# EAGLE design I-GAUGE arduino pro mini Instalasi 2 (EAGLE 7.5.0)
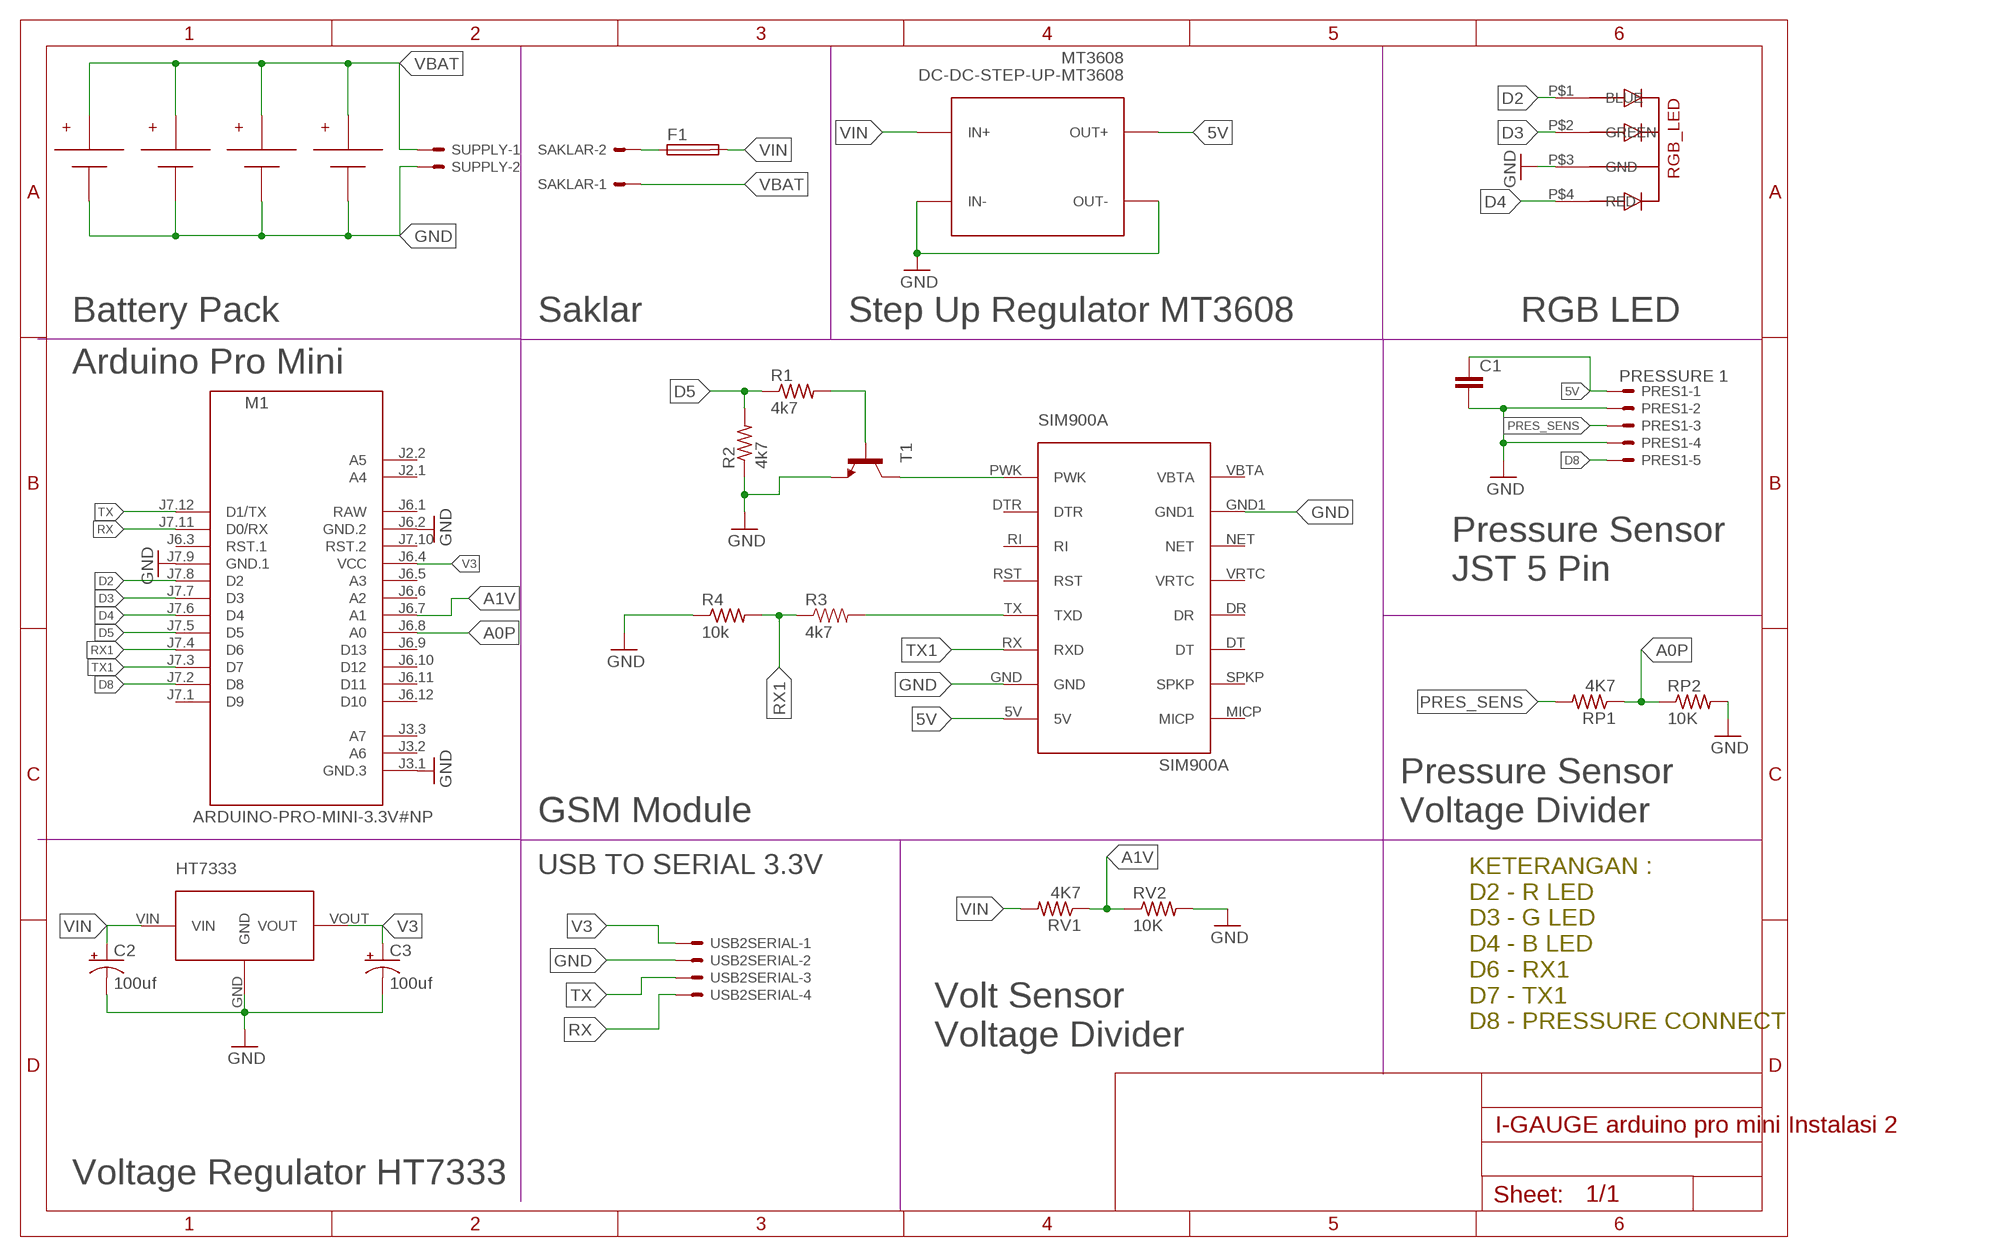
[diagram p0: schematic, sheet 1]

## Parts
C1  C-EUC1206  [C1206]
C2  100uf  CPOL-USCT7343  [CT7343]
C3  100uf  CPOL-USCT7343  [CT7343]
F1  FUSESH22,5  [SH22,5]
HT7333  HT7333_SOT89  [SOT89]
M1  ARDUINO-PRO-MINI-3.3V#NP  [ARDUINO-PRO-MINI#NP]
MT3608  DC-DC-STEP-UP-MT3608  [DC-DC-STEP-UP-MT3608]
PRES1  PRESSURE 1  JST-XH-05-PIN-ROUND-PAD  [JST-XH-05-PACKAGE-ROUND-PAD]
R1  4k7  R-US_R1206  [R1206]
R2  4k7  R-US_R1206  [R1206]
R3  4k7  RESISTOR1206  [1206]
R4  10k  R-US_R1206  [R1206]
RGB_LED  5MMRGBLED  [LED5MMRGB]
RP1  4K7  R-US_M1206  [M1206]
RP2  10K  R-US_M1206  [M1206]
RV1  4K7  R-US_M1206  [M1206]
RV2  10K  R-US_M1206  [M1206]
SAKLAR  JST-XH-02-PIN-ROUND-PAD  [JST-XH-02-PACKAGE-ROUND-PAD]
SUPPLY  JST-XH-02-PIN-ROUND-PAD  [JST-XH-02-PACKAGE-ROUND-PAD]
T1  -NPN-TO92  [TO92]
U$1  SMT18650  [18650SMT]
U$2  SMT18650  [18650SMT]
U$3  SMT18650  [18650SMT]
U$4  SMT18650  [18650SMT]
U$6  SIM900A  [SIM900A]
USB2SERIAL  JST-XH-04-PIN-ROUND-PAD  [JST-XH-04-PACKAGE-ROUND-PAD]

## Nets
5V: C1.1 MT3608.OUT+ PRES1.1 U$6.5V
A0P: M1.J6.8(A0) RP1.1 RP2.1
A1V: M1.J6.7(A1) RV1.1 RV2.1
D2: M1.J7.8(D2) RGB_LED.P$1(BLUE)
D3: M1.J7.7(D3) RGB_LED.P$2(GREEN)
D4: M1.J7.6(D4) RGB_LED.P$4(RED)
D5: M1.J7.5(D5) R1.1 R2.2
D8: M1.J7.2(D8) PRES1.5
GND: C1.2 C2.- C3.- HT7333.GND M1.J3.1(GND.3) M1.J6.2(GND.2) M1.J7.9(GND.1) MT3608.IN- MT3608.OUT- PRES1.2 PRES1.4 R2.1 R4.1 RGB_LED.P$3(GND) RP2.2 RV2.2 SUPPLY.2 T1.1(E) U$1.BATTERY_NEGATIVE(-) U$2.BATTERY_NEGATIVE(-) U$3.BATTERY_NEGATIVE(-) U$4.BATTERY_NEGATIVE(-) U$6.GND U$6.GND1 USB2SERIAL.2
N$3: R1.2 T1.2(B)
N$4: R3.2 U$6.TX(TXD)
N$5: T1.3(C) U$6.PWK
PRES_SENS: PRES1.3 RP1.2
RX: M1.J7.11(D0/RX) USB2SERIAL.4
RX1: M1.J7.4(D6) R3.1 R4.2
TX: M1.J7.12(D1/TX) USB2SERIAL.3
TX1: M1.J7.3(D7) U$6.RX(RXD)
V3: C3.+ HT7333.VOUT M1.J6.4(VCC) USB2SERIAL.1
VBAT: SAKLAR.1 SUPPLY.1 U$1.BATTERY_POSITIVE(+) U$2.BATTERY_POSITIVE(+) U$3.BATTERY_POSITIVE(+) U$4.BATTERY_POSITIVE(+)
VCC: F1.1 SAKLAR.2
VIN: C2.+ F1.2 HT7333.VIN MT3608.IN+ RV1.2
Unconnected: M1.J2.1(A4) M1.J2.2(A5) M1.J3.2(A6) M1.J3.3(A7) M1.J6.3(RST.1) M1.J6.5(A3) M1.J6.6(A2) M1.J6.9(D13) M1.J6.10(D12) M1.J6.11(D11) M1.J6.12(D10) M1.J7.1(D9) M1.J7.10(RST.2) U$6.DR U$6.DT U$6.DTR U$6.MICP U$6.NET U$6.RI U$6.RST U$6.SPKP U$6.VBTA U$6.VRTC

## Notes on the sheet
- Battery Pack | Saklar | Step Up Regulator MT3608 | RGB LED
- Arduino Pro Mini
- Pressure Sensor
  JST 5 Pin
- GSM Module
- Pressure Sensor
  Voltage Divider
- USB TO SERIAL 3.3V
- KETERANGAN :
  D2 - R LED
  D3 - G LED
  D4 - B LED
  D6 - RX1
  D7 - TX1
  D8 - PRESSURE CONNECT
- Volt Sensor
  Voltage Divider
- Voltage Regulator HT7333

## Power pins joined to a net without a drawn wire
RAW: M1.J6.1(RAW)

## Library data of the parts
C1 = rcl:C-EU: CAPACITOR, European symbol
C2 C3 = resistor:CPOL-US: POLARIZED CAPACITOR, American symbol
F1 = fuse:FUSE: Fuse; OC_FARNELL: unknown; OC_NEWARK: unknown
HT7333 = HT7333_SOT89:HT7333_SOT89: SOT89
M1 = diy-modules:ARDUINO-PRO-MINI-*#NP: Arduino Pro Mini (and compatible devices) without programming pads More details available here: https://www.arduino.cc/en/Main/ArduinoBoardProMini Click here to find device on ebay.com <http://www.ebay.com/sch/arduino+pro+mini>
MT3608 = diy-modules:DC-DC-STEP-UP-MT3608: DC/DC Step-Up Regulator based on MT3608 chip MT3608 datasheet available here: https://www.olimex.com/Products/Breadboarding/BB-PWR-3608/resources/MT3608.pdf Click here to find device on ebay.com <http://www.ebay.com/sch/mt3608+module>
PRES1 = jst XH:JST-XH-05-PIN: JST XH Connector 2 Pin Wire to board connector. Pitch: 2,54 mm, (0.100") Number of pins: 5 Created by Rembrandt Electronics www.rembrandtelectronics.com
R1 R2 R4 RP1 RP2 RV1 RV2 = resistor:R-US_: RESISTOR, American symbol
R3 = SparkFun-3-2-07:RESISTOR: Resistor Basic schematic elements and footprints for 0603, 1206, and PTH 1/10th watt (small) resistors.
RGB_LED = led_rgb:5MMRGBLED
SAKLAR SUPPLY = jst XH:JST-XH-02-PIN: JST XH Connector 2 Pin Wire to board connector. Pitch: 2,54 mm, (0.100") Number of pins: 2 Created by Rembrandt Electronics www.rembrandtelectronics.com
T1 = transistor:*-NPN-: NPN Transistror BF959 corrected 2008.03.06
U$1-U$4 = SMT18650:SMT18650
U$6 = SIM900A GSM MODULE:SIM900A
USB2SERIAL = jst XH:JST-XH-04-PIN: JST XH Connector 2 Pin Wire to board connector. Pitch: 2,54 mm, (0.100") Number of pins: 4 Created by Rembrandt Electronics www.rembrandtelectronics.com

## Board
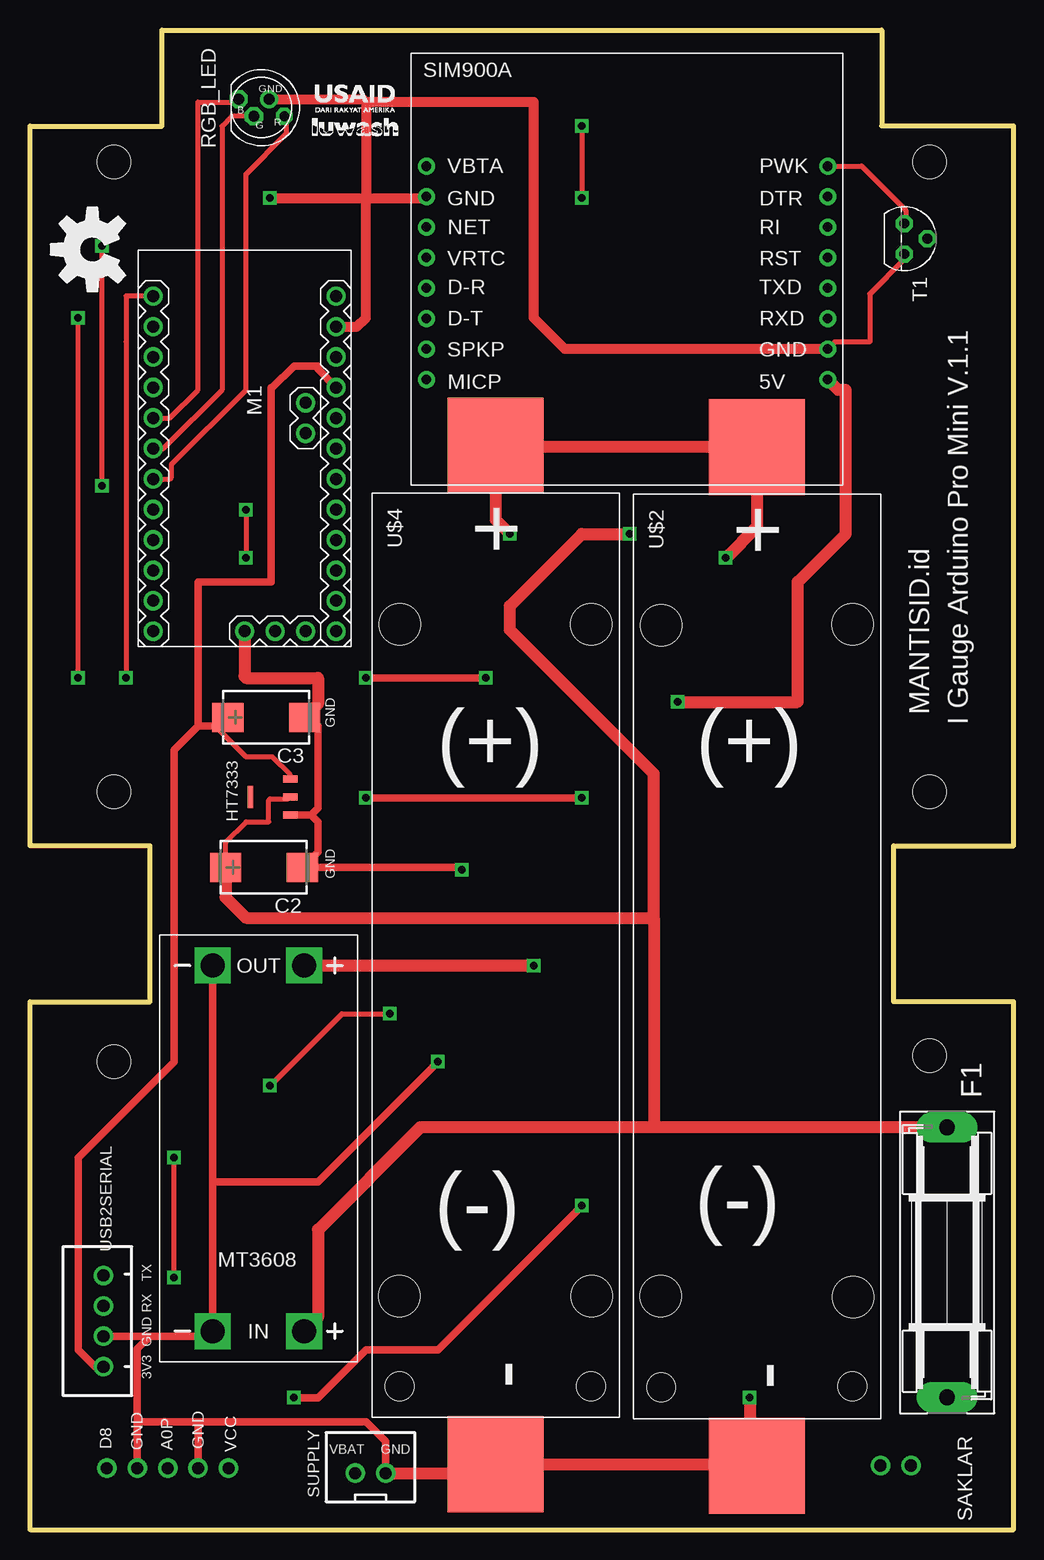
[diagram p1: board, top side]
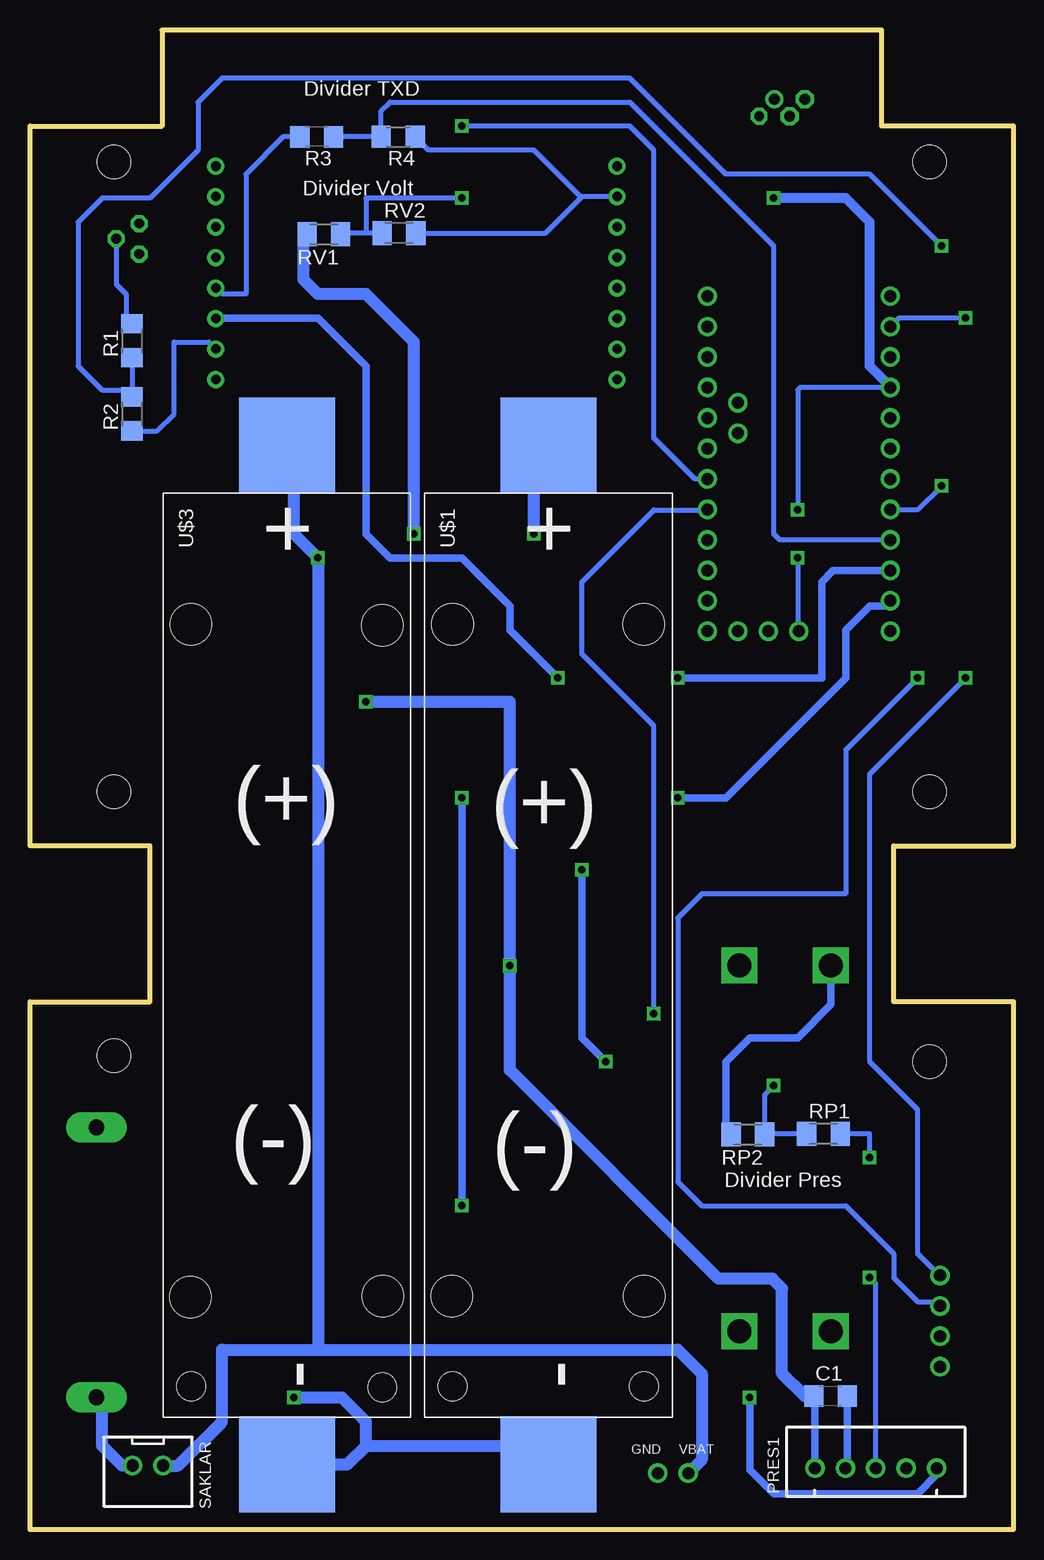
[diagram p2: board, bottom side, seen from below]

Size 82 x 125 mm. Coordinates in mm from the lower left corner, seen from the top.
Outline: 0,0 82,0 82,44 72,44 72,57 82,57 82,117 71,117 71,125 11,125 11,117 0,117 0,57 10,57 10,44 0,44 0,0
Copper layers (1*16): Top 0.035mm / dielectric 1.5mm / Bottom 0.035mm
Design rules "SparkFun": minimum track width 8mil, minimum drill 20mil, track to track 8mil, track to pad 8mil, pad to pad 8mil, via to via 8mil, smd to smd 8mil, copper to edge 8mil, drill to drill 8mil, minimum pad ring 12mil, minimum via ring 10mil, stop-mask expansion 4mil, vias tented up to drill 20mil, thermal gap 10mil
Holes 2.8 mm at 75,39.5 7,39 75,61.5 7,61.5 75,114 7,114

### Footprints (pad centres in the part's own frame; a part is rotated, then mirrored left to right if it is on the bottom)
C1206 = smd 1.6 x 1.8: 1 -1.4,0; 2 1.4,0
CT7343 = smd 2.6 x 2.4: + 3.2,0; - -3.2,0
SH22,5 = drill 1.321 pad 2.54 long: 1 -11.252,0; 2 11.252,0
SOT89 = smd 0.559 x 1.194: GND -1.499,-0.597; VIN 0,-0.597; VOUT 1.499,-0.597 | smd 1.829 x 0.457: P$4 0,2.743
ARDUINO-PRO-MINI#NP = drill 1: J2.1 -1.27,5.08; J2.2 -3.81,5.08; J3.1 15.24,0; J3.2 15.24,2.54; J3.3 15.24,5.08; J6.1 -12.7,7.62; J6.2 -10.16,7.62; J6.3 -7.62,7.62; J6.4 -5.08,7.62; J6.5 -2.54,7.62; J6.6 0,7.62; J6.7 2.54,7.62; J6.8 5.08,7.62; J6.9 7.62,7.62; J6.10 10.16,7.62; J6.11 12.7,7.62; J6.12 15.24,7.62; J7.1 15.24,-7.62; J7.2 12.7,-7.62; J7.3 10.16,-7.62; J7.4 7.62,-7.62; J7.5 5.08,-7.62; J7.6 2.54,-7.62; J7.7 0,-7.62; J7.8 -2.54,-7.62; J7.9 -5.08,-7.62; J7.10 -7.62,-7.62; J7.11 -10.16,-7.62; J7.12 -12.7,-7.62
DC-DC-STEP-UP-MT3608 = drill 2 pad 2.8 square: IN+ 15.24,3.81; IN- 15.24,-3.81; OUT+ -15.24,3.81; OUT- -15.24,-3.81
JST-XH-05-PACKAGE-ROUND-PAD = drill 1.016: 1 -5.08,0; 2 -2.54,0; 3 0,0; 4 2.54,0; 5 5.08,0
R1206 = smd 1.6 x 1.803: 1 -1.422,0; 2 1.422,0
1206 = smd 1.6 x 1.8: 1 -1.4,0; 2 1.4,0
LED5MMRGB = drill 0.9 pad 1.27 octagon: P$1 -1.905,0.714; P$2 -0.635,-0.714 | drill 0.9 pad 1.27: P$3 0.635,0.714 | drill 0.8 pad 1.27 octagon: P$4 1.905,-0.714
M1206 = smd 1.6 x 2: 1 -1.4,0; 2 1.4,0
JST-XH-02-PACKAGE-ROUND-PAD = drill 1.016: 1 -1.27,0; 2 1.27,0
TO92 = drill 0.813 octagon: 1 1.27,0; 2 0,1.905; 3 -1.27,0
18650SMT = smd 8 x 8: BATTERY_NEGATIVE 80.98,10.32; BATTERY_POSITIVE -3.95,10.32 | hole 3.45: 66.925,18.325; 10.925,2.325 | hole 2.39: 74.455,2.325
SIM900A = drill 0.8: 5V 34.73,8.81; DR 1.27,16.43; DT 1.27,13.89; DTR 34.73,24.05; GND 34.73,11.35; GND1 1.27,24.05; MICP 1.27,8.81; NET 1.27,21.51; PWK 34.73,26.59; RI 34.73,21.51; RST 34.73,18.97; RX 34.73,13.89; SPKP 1.27,11.35; TX 34.73,16.43; VBTA 1.27,26.59; VRTC 1.27,18.97
JST-XH-04-PACKAGE-ROUND-PAD = drill 1.016: 1 -3.81,0; 2 -1.27,0; 3 1.27,0; 4 3.81,0

### Placement (x,y rotation side)
C1  15.26,11.13 0 bottom
C2  19.5,55.2 180 top
C3  19.7,67.7 180 top
F1  76.46,22.28 90 top
HT7333  21.11,61.07 90 top
M1  17.9,90.12 270 top
MT3608  19.06,31.78 270 top
PRES1  11.48,5.11 0 bottom
R1  73.5,99.1 90 bottom
R2  73.5,93 90 bottom
R3  58.1,116.1 180 bottom
R4  51.3,116.1 180 bottom
RGB_LED  19.3,118.53 0 top
RP1  15.85,32.98 0 bottom
RP2  22.14,32.93 180 bottom
RV1  57.5,107.97 180 bottom
RV2  51.24,108.07 0 bottom
SAKLAR  72.17,5.33 180 bottom
SUPPLY  28.38,4.69 0 top
T1  72.9,107.6 270 top
U$1  49.1,86.4 270 bottom
U$2  50.3,86.3 270 top
U$3  70.9,86.4 270 bottom
U$4  28.5,86.4 270 top
U$6  31.78,87.06 0 top
U$7  [OSHW-LOGO-L]  5.2,106.7 90 top
USB2SERIAL  6.13,17.38 90 top

### Tracks (layer width: path | path; a pad name or v marks a point on that pad's centre or on a via)
5V  (via drill 0.6)
  Top 1.016: MT3608.OUT+ 41.98,47.02 v42,47 | v54,69 64,69 64,79 68,83 68,95 67.38,95 U$6.5V
  Bottom 0.61: PRES1.1 16.56,11.03 C1.1
  Bottom 1.016: v54,69 42,69 v42,47 42,38.3 24.6,20.9 20.1,20.9 19.3,20.1 19.3,13 17.43,11.13 C1.1
A0P  (via drill 0.6)
  Top 0.406: v20,37 26,43 v30,43
  Bottom 0.406: RP1.1 20.7,32.98 RP2.1 20.74,36.26 v20,37 | v30,43 30,67 36,73 36,79 30,85 25.55,85 M1.J6.8
A1V  (via drill 0.6)
  Top 0.406: v46,117 v46,111
  Bottom 0.406: RV2.1 54,108.07 | 54,108.07 56.01,108.07 RV1.1 | M1.J6.7 26.58,87.58 30,91 30,115 32,117 v46,117 | v46,111 54,111 54,108.07
D2
  Top 0.406: M1.J7.8 11.66,92.66 14,95 14,119 17.16,119 RGB_LED.P$1
D3
  Top 0.406: RGB_LED.P$2 16.81,117.81 16,117 16,95 11.1,90.1 10.29,90.1 M1.J7.7
D4
  Top 0.406: M1.J7.6 11.68,87.58 11.8,87.7 11.8,88.8 18,95 18,113 21.4,116.4 21.4,117.62 RGB_LED.P$4
D5  (via drill 0.6)
  Top 0.406: v6,87 v6,107
  Bottom 0.406: R1.1 73.5,95 | 73.5,95 R2.2 | M1.J7.5 7.96,85.04 v6,87 | v6,107 12,113 24,113 32,121 66,121 68,119 68,115 72,111 76,111 78,109 78,97 76,95 73.5,95
D8  (via drill 0.6)
  Top 0.61: v22,11 24,11 28,15 34,15 v46,27 | v46,61 v28,61
  Bottom 0.61: PRES1.5 6.4,4.6 8,3 20,3 22,5 v22,11 | v46,27 v46,61 | v28,61 24,61 14,71 14,75 12,77 10.69,77 M1.J7.2
GND  (via drill 0.6)
  Top 0.406: T1.1 72.9,105.9 70,103 70,99 67.1,99 U$6.GND | v18,85 v18,81
  Top 0.61: HT7333.GND 23.43,59.57 | 23.43,59.57 24,59 24,56.5 C2.- 35.8,55.2 v36,55 | C3.- 23.3,67.7 24,67 24,60.14 23.43,59.57 | USB2SERIAL.2 10,16.1 | 10,16.1 14.81,16.1 MT3608.IN- 15.25,29 | MT3608.OUT- 15.25,29 | PRES1.4 8.94,9 | 8.94,9 8.94,15.05 10,16.1 | PRES1.2 14.02,8.98 | 14.02,8.98 14,9 8.94,9 | SUPPLY.2 29.65,7.35 28,9 14.04,9 14.02,8.98 | v34,39 24,29 15.25,29
  Top 0.813: v20,111 28,111 | 28,111 32.94,111 U$6.GND1 | M1.J6.2 27.28,100.28 28,101 28,111 | RGB_LED.P$3 27.76,119.24 28,119 | 28,119 28,111 | U$6.GND 44.59,98.41 42,101 42,119 28,119
  Top 1.016: SUPPLY.2 38.09,4.69 U$4.BATTERY_NEGATIVE 60,5.42 60,5.94 | v60,11 60,5.94 | 60,5.94 U$2.BATTERY_NEGATIVE | M1.J3.1 17.89,71.11 18,71 24,71 24,68.8 C3.-
  Bottom 0.406: R2.1 71.42,91.58 70,93 70,99 67.1,99 U$6.GND | U$6.GND1 36,111.11 | 36,111.11 36.11,111.11 40,115 48.78,115 R4.1 | RV2.2 39.04,108.07 36,111.11 | M1.J7.9 17.8,95.2 18,95 v18,85 | v18,81 18,74.98 M1.J3.1
  Bottom 0.61: MT3608.OUT- 15.25,43.75 18,41 22,41 24,39 24,33.39 RP2.2 | C1.2 13.86,5.27 PRES1.2 | v36,55 36,41 v34,39
  Bottom 0.813: M1.J7.9 10.28,95.28 12,97 12,109 14,111 v20,111
  Bottom 1.016: U$3.BATTERY_NEGATIVE 55.58,5.42 54,7 | 54,7 54,9 56,11 v60,11 | 54,7 40,7 40,6.64 U$1.BATTERY_NEGATIVE
N$3
  Bottom 0.406: T1.2 74.81,103.81 74,103 74,101.02 R1.2
N$4
  Bottom 0.406: R3.2 60.9,116.1 64,113 64,103 66.02,103 U$6.TX
N$5
  Top 0.406: U$6.PWK 69.35,113.65 73,110 73,108.97 T1.3
PRES_SENS  (via drill 0.6)
  Top 0.406: v12,21 v12,31
  Bottom 0.406: PRES1.3 11.48,20.48 v12,21 | v12,31 12,33 14.43,33 RP1.2
RX  (via drill 0.6)
  Top 0.406: v4,71 v4,101
  Bottom 0.406: USB2SERIAL.4 6.18,21.19 8,23 8,35 12,39 12,63 v4,71 | v4,101 9.55,101 M1.J7.11
RX1
  Bottom 0.406: R3.1 R4.2 52.72,118.28 52,119 32,119 20,107 20,83 19.5,82.5 M1.J7.4
TX  (via drill 0.6)
  Top 0.406: M1.J7.12 8.02,102.82 8,99 v8,71
  Bottom 0.406: v8,71 14,65 14,53 26,53 28,51 28,29 26,27 14,27 10,23 10,21 8,19 6.48,19 USB2SERIAL.3
TX1  (via drill 0.6)
  Top 0.61: v28,71 v38,71
  Bottom 0.61: M1.J7.3 15.04,79.96 16,79 16,71 v28,71 | v38,71 42,75 42,77 46,81 52,81 54,83 54,97 58,101 66.45,101 U$6.RX
V3
  Top 0.406: HT7333.VOUT 21.71,62.89 20.2,64.4 18,64.4 15.6,66.8 C3.+
  Top 0.61: 14,67 14,79 20.1,79 20.1,95.2 20.2,95.2 22,97 24,97 24,96.71 M1.J6.4 | 14,67 15.4,67 15.6,66.8 | USB2SERIAL.1 5.43,13.56 4,15 4,31 12,39 12,65 14,67
VBAT  (via drill 0.6)
  Top 1.016: v58,81 60.62,83.62 U$2.BATTERY_POSITIVE 38.92,90.25 U$4.BATTERY_POSITIVE 38.82,84.18 v40,83
  Bottom 1.016: SAKLAR.1 69.67,5.33 66,9 66,15 58,15 | 58,15 28,15 26,13 26,5.8 SUPPLY.1 | U$3.BATTERY_POSITIVE 60,89.77 60,83 v58,81 58,15 | v40,83 40,89.13 U$1.BATTERY_POSITIVE
VCC
  Bottom 1.016: SAKLAR.2 74.33,5.33 76,7 76,10.57 F1.1
VIN  (via drill 0.6)
  Top 0.406: C2.+ 16.3,57.3 18,59 19.9,59 19.9,60.8 20,60.9 21.54,60.9 HT7333.VIN
  Top 1.016: F1.2 52,33.53 | 52,33.53 32.53,33.53 24,25 24,17.67 MT3608.IN+ | C2.+ 16.3,52.7 18,51 52,51 | 52,51 52,33.53 | 52,51 52,63 40,75 40,77 46,83 v50,83
  Bottom 1.016: v50,83 50,99 54,103 58,103 59.2,104.2 59.2,107.68 RV1.2

### Text on the board
tNames: MANTISID.id | GND | I Gauge Arduino Pro Mini V.1.1 | (+) | (+) | GND | (-) | (-) | TX | RX | GND | 3V3 | VCC | SAKLAR | D8 | GND | A0P | GND | VBAT | GND
bNames: Divider TXD | Divider Volt | (+) | (+) | Divider Pres | (-) | (-) | GND | VBAT